# Altium schematic sheet dc link.SchDoc
size A; SheetNumber: 1; SheetTotal: 4
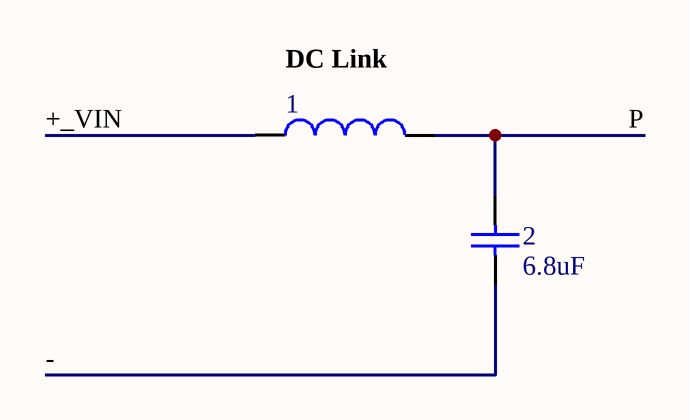
[diagram p0: dc link.SchDoc]

## Parts
1  Inductor  (value not drawn)
2  value 6.8uF  (hidden comment: Capacitor)

## Nets
+_VIN: 1.1
-: 2.1
P: 1.2 2.2

## Notes on the sheet
- (near 1) DC Link

## Library data of the parts
1 = Inductor: SimulationGenericComponent: True
2 = Capacitor: SimulationGenericComponent: True